# EAGLE schematic DanielDist_board_1.0 (EAGLE 7.6.0)
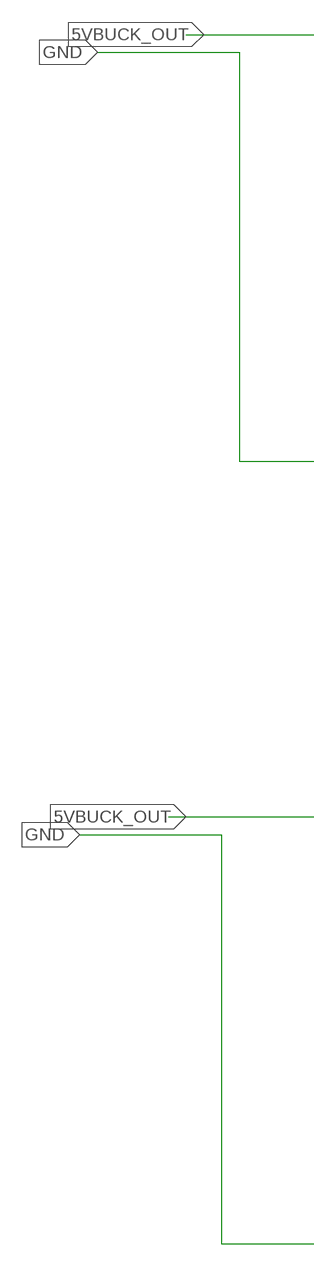
[diagram p0: schematic, sheet 1, part 1 of 3]
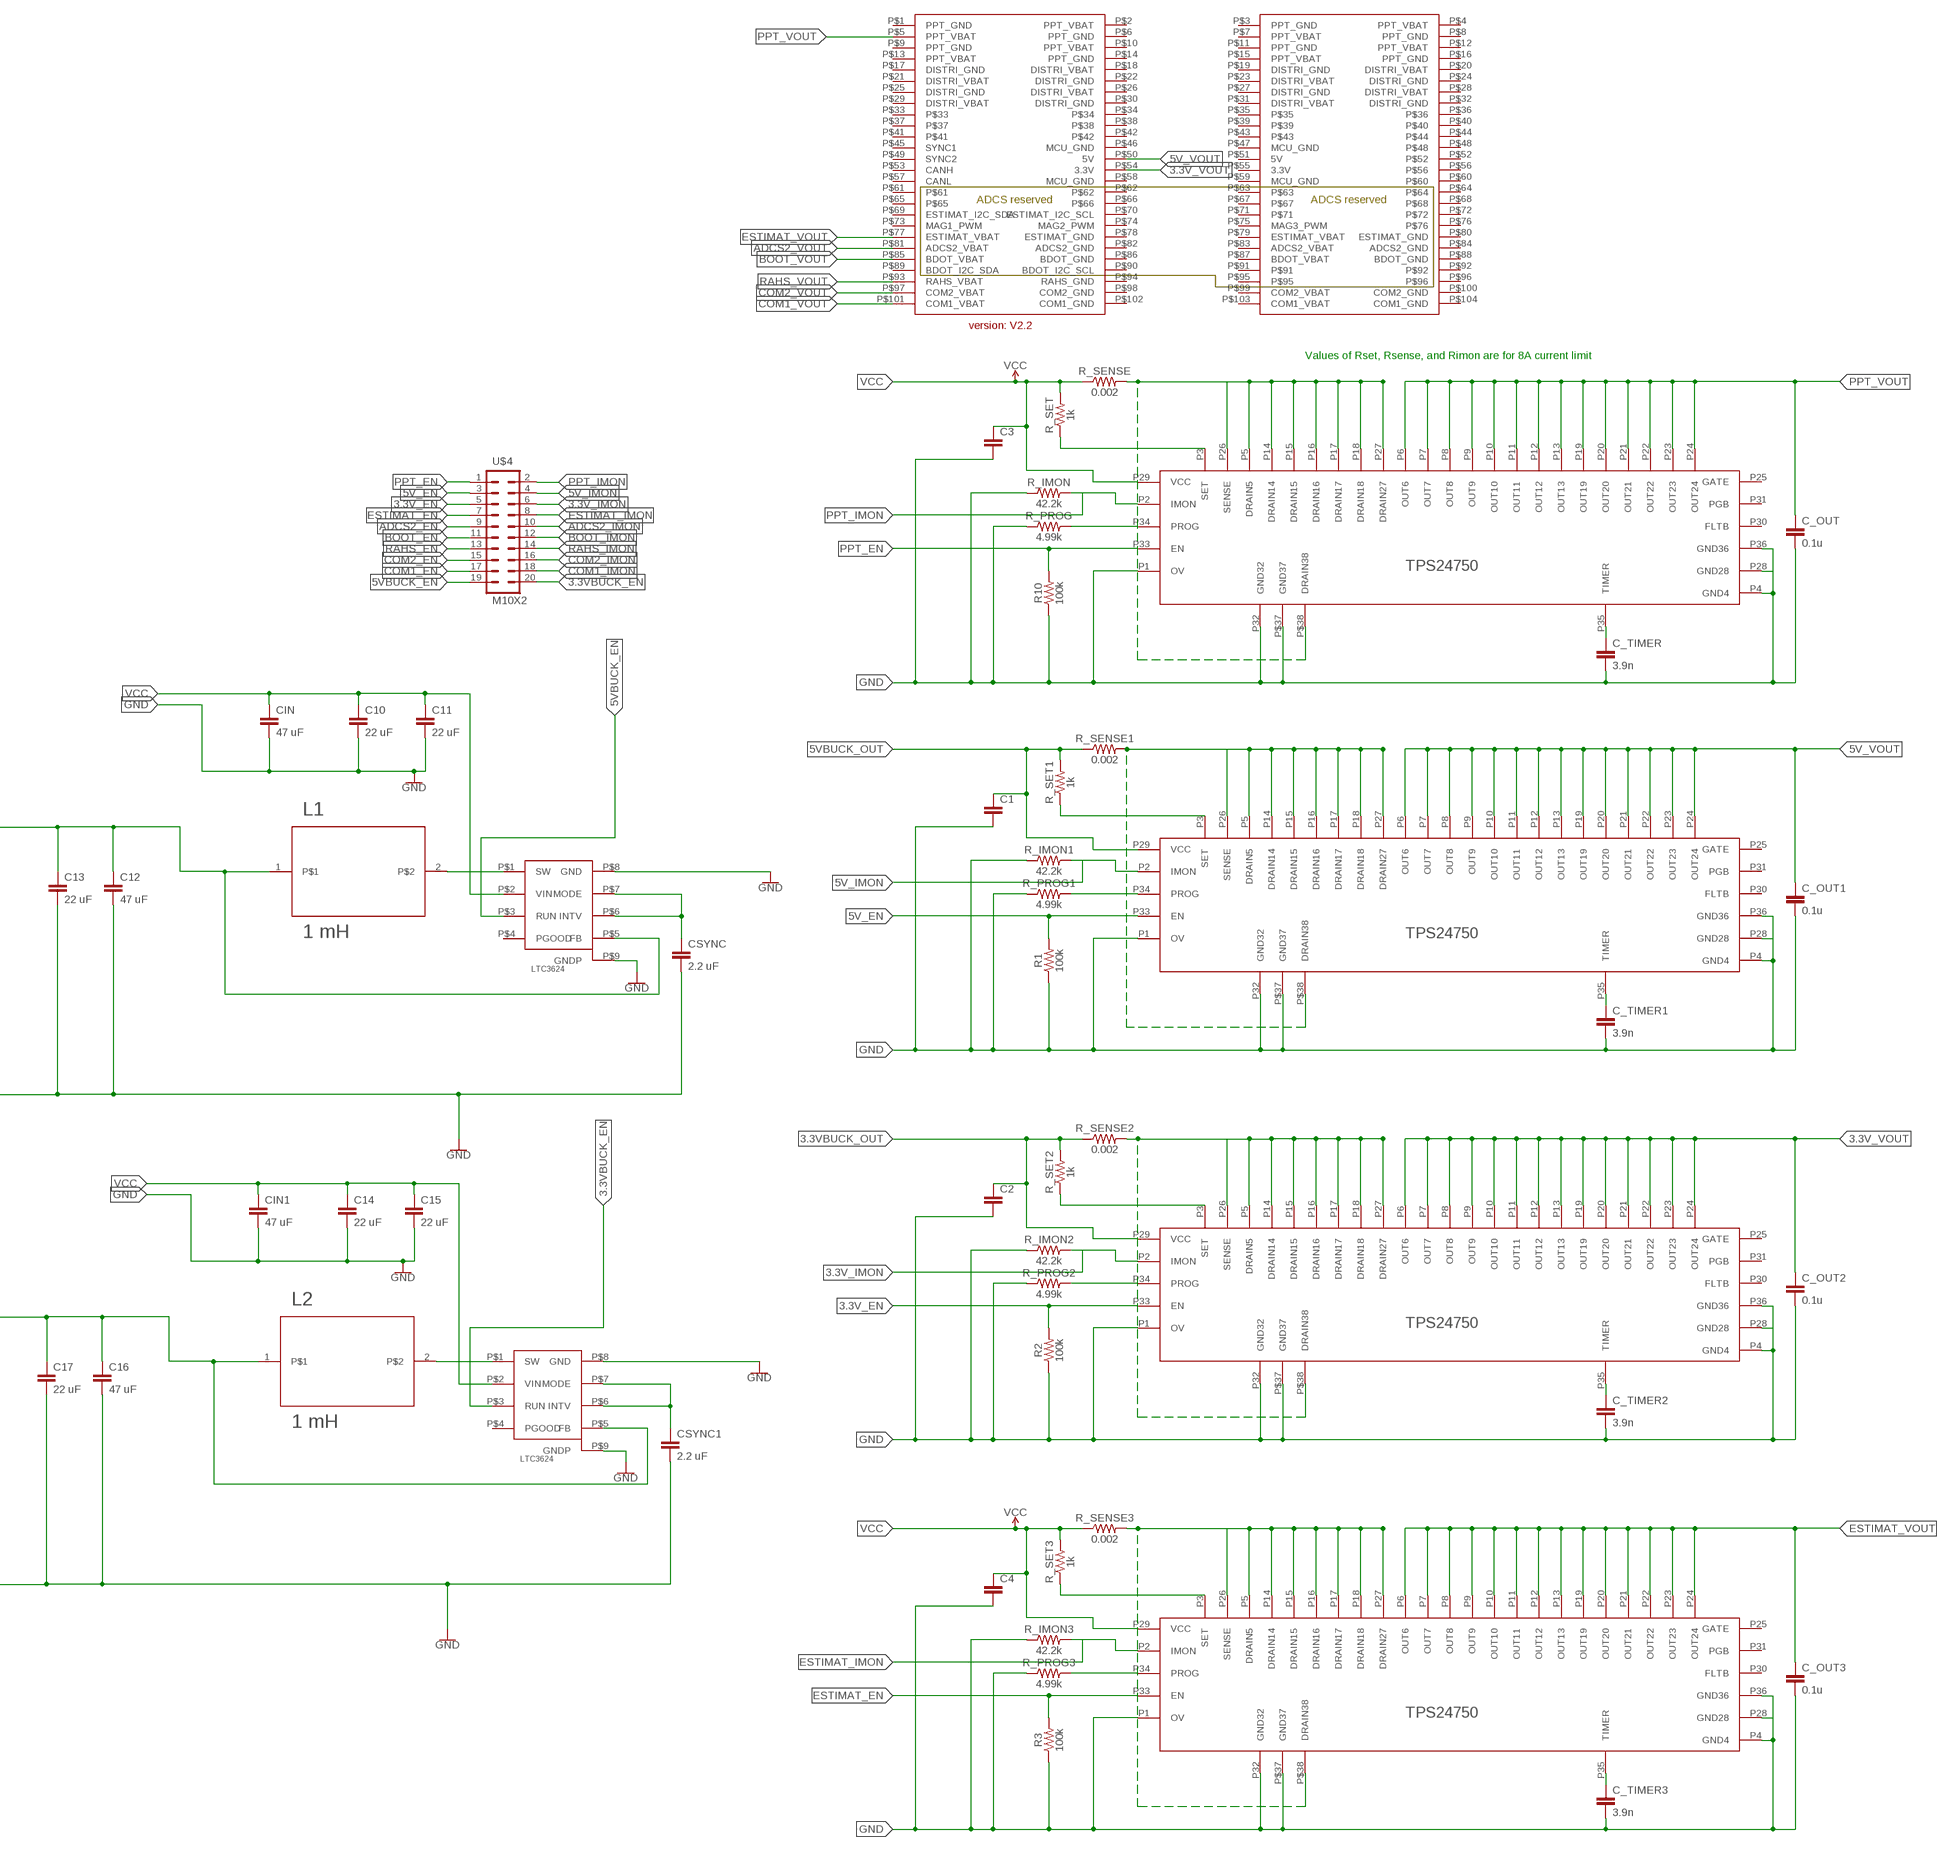
[diagram p1: schematic, sheet 1, part 2 of 3]
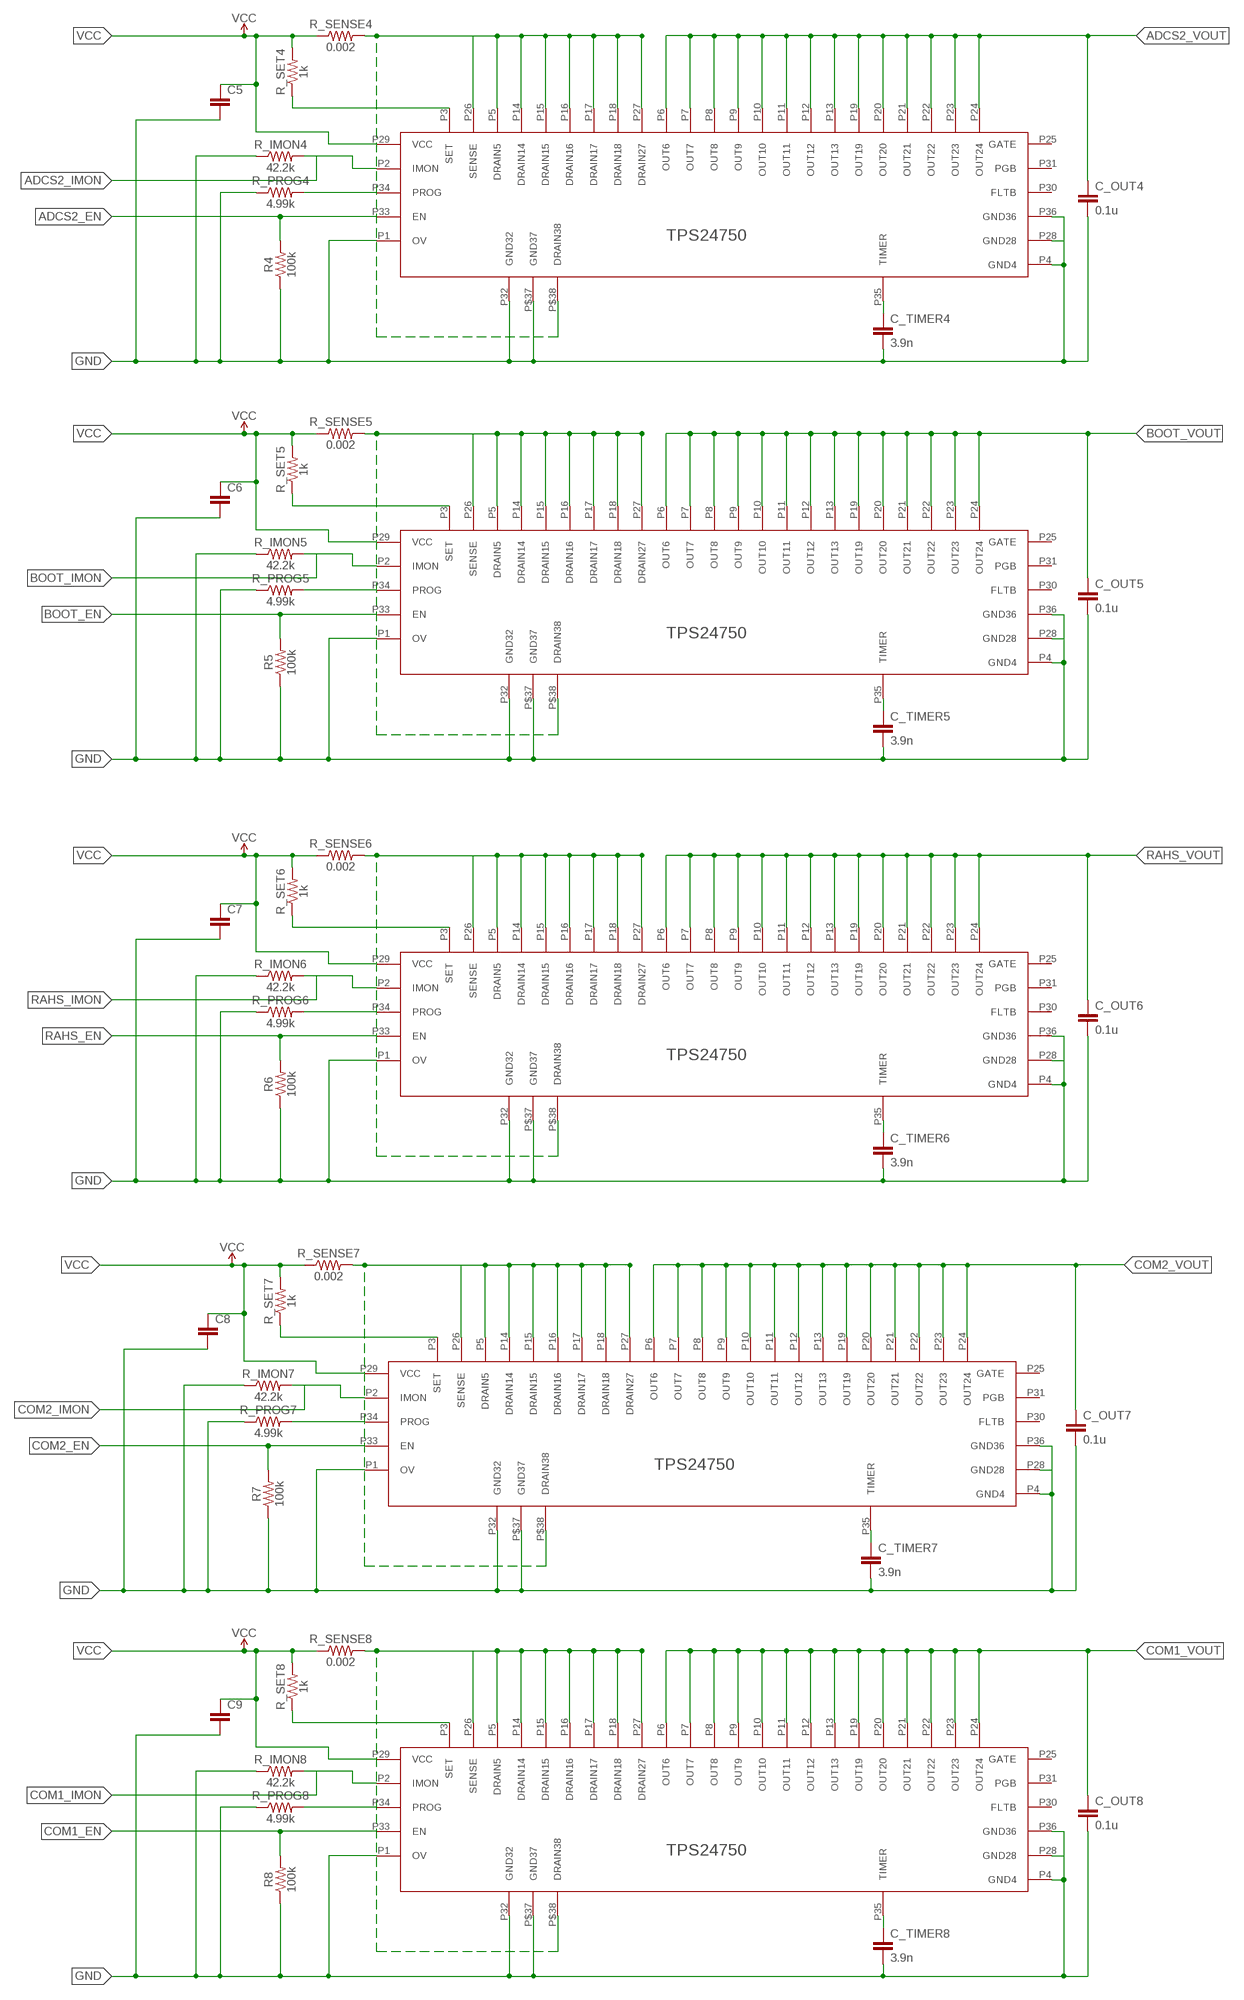
[diagram p2: schematic, sheet 1, part 3 of 3]

## Parts
C1  GEN_CAP_0805SMD  [0805]
C2  GEN_CAP_0805SMD  [0805]
C3  GEN_CAP_0805SMD  [0805]
C4  GEN_CAP_0805SMD  [0805]
C5  GEN_CAP_0805SMD  [0805]
C6  GEN_CAP_0805SMD  [0805]
C7  GEN_CAP_0805SMD  [0805]
C8  GEN_CAP_0805SMD  [0805]
C9  GEN_CAP_0805SMD  [0805]
C10  22 uF  GENERIC_CAPACITOR_1206  [1206]
C11  22 uF  GENERIC_CAPACITOR_1206  [1206]
C12  47 uF  GENERIC_CAPACITOR_1206  [1206]
C13  22 uF  GENERIC_CAPACITOR_1206  [1206]
C14  22 uF  GENERIC_CAPACITOR_1206  [1206]
C15  22 uF  GENERIC_CAPACITOR_1206  [1206]
C16  47 uF  GENERIC_CAPACITOR_1206  [1206]
C17  22 uF  GENERIC_CAPACITOR_1206  [1206]
C_OUT  0.1u  GEN_CAP_0805SMD  [0805]
C_OUT1  0.1u  GEN_CAP_0805SMD  [0805]
C_OUT2  0.1u  GEN_CAP_0805SMD  [0805]
C_OUT3  0.1u  GEN_CAP_0805SMD  [0805]
C_OUT4  0.1u  GEN_CAP_0805SMD  [0805]
C_OUT5  0.1u  GEN_CAP_0805SMD  [0805]
C_OUT6  0.1u  GEN_CAP_0805SMD  [0805]
C_OUT7  0.1u  GEN_CAP_0805SMD  [0805]
C_OUT8  0.1u  GEN_CAP_0805SMD  [0805]
C_TIMER  3.9n  GEN_CAP_0805SMD  [0805]
C_TIMER1  3.9n  GEN_CAP_0805SMD  [0805]
C_TIMER2  3.9n  GEN_CAP_0805SMD  [0805]
C_TIMER3  3.9n  GEN_CAP_0805SMD  [0805]
C_TIMER4  3.9n  GEN_CAP_0805SMD  [0805]
C_TIMER5  3.9n  GEN_CAP_0805SMD  [0805]
C_TIMER6  3.9n  GEN_CAP_0805SMD  [0805]
C_TIMER7  3.9n  GEN_CAP_0805SMD  [0805]
C_TIMER8  3.9n  GEN_CAP_0805SMD  [0805]
CIN  47 uF  GENERIC_CAPACITOR_1206  [1206]
CIN1  47 uF  GENERIC_CAPACITOR_1206  [1206]
CSYNC  2.2 uF  GENERIC_CAPACITOR_0805  [0805]
CSYNC1  2.2 uF  GENERIC_CAPACITOR_0805  [0805]
L1  1 mH  XAL4030-332ME  [COILCRAFT]
L2  1 mH  XAL4030-332ME  [COILCRAFT]
R1  100k  GEN_RES_0805SMD  [0805]
R2  100k  GEN_RES_0805SMD  [0805]
R3  100k  GEN_RES_0805SMD  [0805]
R4  100k  GEN_RES_0805SMD  [0805]
R5  100k  GEN_RES_0805SMD  [0805]
R6  100k  GEN_RES_0805SMD  [0805]
R7  100k  GEN_RES_0805SMD  [0805]
R8  100k  GEN_RES_0805SMD  [0805]
R10  100k  GEN_RES_0805SMD  [0805]
R_IMON  42.2k  GEN_RES_0805SMD  [0805]
R_IMON1  42.2k  GEN_RES_0805SMD  [0805]
R_IMON2  42.2k  GEN_RES_0805SMD  [0805]
R_IMON3  42.2k  GEN_RES_0805SMD  [0805]
R_IMON4  42.2k  GEN_RES_0805SMD  [0805]
R_IMON5  42.2k  GEN_RES_0805SMD  [0805]
R_IMON6  42.2k  GEN_RES_0805SMD  [0805]
R_IMON7  42.2k  GEN_RES_0805SMD  [0805]
R_IMON8  42.2k  GEN_RES_0805SMD  [0805]
R_PROG  4.99k  GEN_RES_0805SMD  [0805]
R_PROG1  4.99k  GEN_RES_0805SMD  [0805]
R_PROG2  4.99k  GEN_RES_0805SMD  [0805]
R_PROG3  4.99k  GEN_RES_0805SMD  [0805]
R_PROG4  4.99k  GEN_RES_0805SMD  [0805]
R_PROG5  4.99k  GEN_RES_0805SMD  [0805]
R_PROG6  4.99k  GEN_RES_0805SMD  [0805]
R_PROG7  4.99k  GEN_RES_0805SMD  [0805]
R_PROG8  4.99k  GEN_RES_0805SMD  [0805]
R_SENSE  0.002  GEN_RES_2010SMD  [2010]
R_SENSE1  0.002  GEN_RES_2010SMD  [2010]
R_SENSE2  0.002  GEN_RES_2010SMD  [2010]
R_SENSE3  0.002  GEN_RES_2010SMD  [2010]
R_SENSE4  0.002  GEN_RES_2010SMD  [2010]
R_SENSE5  0.002  GEN_RES_2010SMD  [2010]
R_SENSE6  0.002  GEN_RES_2010SMD  [2010]
R_SENSE7  0.002  GEN_RES_2010SMD  [2010]
R_SENSE8  0.002  GEN_RES_2010SMD  [2010]
R_SET  1k  GEN_RES_0805SMD  [0805]
R_SET1  1k  GEN_RES_0805SMD  [0805]
R_SET2  1k  GEN_RES_0805SMD  [0805]
R_SET3  1k  GEN_RES_0805SMD  [0805]
R_SET4  1k  GEN_RES_0805SMD  [0805]
R_SET5  1k  GEN_RES_0805SMD  [0805]
R_SET6  1k  GEN_RES_0805SMD  [0805]
R_SET7  1k  GEN_RES_0805SMD  [0805]
R_SET8  1k  GEN_RES_0805SMD  [0805]
U$1  TI_SWITCH_TPS24750  [QFN-36]
U$2  2X26_CONNECTOR_(V2.2)  [4X26_CONNECTOR_(V2.2)]
U$4  M10X2  [2X10]
U$5  TI_SWITCH_TPS24750  [QFN-36]
U$6  TI_SWITCH_TPS24750  [QFN-36]
U$7  TI_SWITCH_TPS24750  [QFN-36]
U$8  TI_SWITCH_TPS24750  [QFN-36]
U$9  TI_SWITCH_TPS24750  [QFN-36]
U$10  TI_SWITCH_TPS24750  [QFN-36]
U$11  TI_SWITCH_TPS24750  [QFN-36]
U$12  TI_SWITCH_TPS24750  [QFN-36]
U$13  LINEAR_BUCK_LTC3624  [8-LFCSP]
U$14  LINEAR_BUCK_LTC3624  [8-LFCSP]

## Nets
3.3V_EN: R2.2 U$4.5 U$6.P33(EN)
3.3V_IMON: R_IMON2.2 U$4.6 U$6.P2(IMON)
3.3V_VOUT: C_OUT2.1 U$2.P$54(3.3V) U$6.P6(OUT6) U$6.P7(OUT7) U$6.P8(OUT8) U$6.P9(OUT9) U$6.P10(OUT10) U$6.P11(OUT11) U$6.P12(OUT12) U$6.P13(OUT13) U$6.P19(OUT19) U$6.P20(OUT20) U$6.P21(OUT21) U$6.P22(OUT22) U$6.P23(OUT23) U$6.P24(OUT24)
3.3VBUCK_EN: U$4.20 U$14.P$3(RUN)
3.3VBUCK_OUT: C2.1 C16.1 C17.1 L2.1 R_SENSE2.1 R_SET2.2 U$6.P29(VCC) U$14.P$5(FB)
5V_EN: R1.2 U$4.3 U$5.P33(EN)
5V_IMON: R_IMON1.2 U$4.4 U$5.P2(IMON)
5V_VOUT: C_OUT1.1 U$2.P$50(5V) U$5.P6(OUT6) U$5.P7(OUT7) U$5.P8(OUT8) U$5.P9(OUT9) U$5.P10(OUT10) U$5.P11(OUT11) U$5.P12(OUT12) U$5.P13(OUT13) U$5.P19(OUT19) U$5.P20(OUT20) U$5.P21(OUT21) U$5.P22(OUT22) U$5.P23(OUT23) U$5.P24(OUT24)
5VBUCK_EN: U$4.19 U$13.P$3(RUN)
5VBUCK_OUT: C1.1 C12.1 C13.1 L1.1 R_SENSE1.1 R_SET1.2 U$5.P29(VCC) U$13.P$5(FB)
ADCS2_EN: R4.2 U$4.9 U$8.P33(EN)
ADCS2_IMON: R_IMON4.2 U$4.10 U$8.P2(IMON)
ADCS2_VOUT: C_OUT4.1 U$2.P$81(ADCS2_VBAT) U$8.P6(OUT6) U$8.P7(OUT7) U$8.P8(OUT8) U$8.P9(OUT9) U$8.P10(OUT10) U$8.P11(OUT11) U$8.P12(OUT12) U$8.P13(OUT13) U$8.P19(OUT19) U$8.P20(OUT20) U$8.P21(OUT21) U$8.P22(OUT22) U$8.P23(OUT23) U$8.P24(OUT24)
BOOT_EN: R5.2 U$9.P33(EN)
BOOT_IMON: R_IMON5.2 U$9.P2(IMON)
BOOT_VOUT: C_OUT5.1 U$2.P$85(BDOT_VBAT) U$9.P6(OUT6) U$9.P7(OUT7) U$9.P8(OUT8) U$9.P9(OUT9) U$9.P10(OUT10) U$9.P11(OUT11) U$9.P12(OUT12) U$9.P13(OUT13) U$9.P19(OUT19) U$9.P20(OUT20) U$9.P21(OUT21) U$9.P22(OUT22) U$9.P23(OUT23) U$9.P24(OUT24)
COM1_EN: R8.2 U$4.17 U$12.P33(EN)
COM1_IMON: R_IMON8.2 U$12.P2(IMON)
COM1_VOUT: C_OUT8.1 U$2.P$101(COM1_VBAT) U$12.P6(OUT6) U$12.P7(OUT7) U$12.P8(OUT8) U$12.P9(OUT9) U$12.P10(OUT10) U$12.P11(OUT11) U$12.P12(OUT12) U$12.P13(OUT13) U$12.P19(OUT19) U$12.P20(OUT20) U$12.P21(OUT21) U$12.P22(OUT22) U$12.P23(OUT23) U$12.P24(OUT24)
COM2_EN: R7.2 U$11.P33(EN)
COM2_IMON: R_IMON7.2 U$4.16 U$11.P2(IMON)
COM2_VOUT: C_OUT7.1 U$2.P$97(COM2_VBAT) U$11.P6(OUT6) U$11.P7(OUT7) U$11.P8(OUT8) U$11.P9(OUT9) U$11.P10(OUT10) U$11.P11(OUT11) U$11.P12(OUT12) U$11.P13(OUT13) U$11.P19(OUT19) U$11.P20(OUT20) U$11.P21(OUT21) U$11.P22(OUT22) U$11.P23(OUT23) U$11.P24(OUT24)
DRAIN: R_SENSE.2 U$1.P5(DRAIN5) U$1.P14(DRAIN14) U$1.P15(DRAIN15) U$1.P16(DRAIN16) U$1.P17(DRAIN17) U$1.P18(DRAIN18) U$1.P26(SENSE) U$1.P27(DRAIN27) U$1.P$38(DRAIN38)
DRAIN1: R_SENSE1.2 U$5.P5(DRAIN5) U$5.P14(DRAIN14) U$5.P15(DRAIN15) U$5.P16(DRAIN16) U$5.P17(DRAIN17) U$5.P18(DRAIN18) U$5.P26(SENSE) U$5.P27(DRAIN27) U$5.P$38(DRAIN38)
DRAIN2: R_SENSE2.2 U$6.P5(DRAIN5) U$6.P14(DRAIN14) U$6.P15(DRAIN15) U$6.P16(DRAIN16) U$6.P17(DRAIN17) U$6.P18(DRAIN18) U$6.P26(SENSE) U$6.P27(DRAIN27) U$6.P$38(DRAIN38)
DRAIN3: R_SENSE3.2 U$7.P5(DRAIN5) U$7.P14(DRAIN14) U$7.P15(DRAIN15) U$7.P16(DRAIN16) U$7.P17(DRAIN17) U$7.P18(DRAIN18) U$7.P26(SENSE) U$7.P27(DRAIN27) U$7.P$38(DRAIN38)
DRAIN4: R_SENSE4.2 U$8.P5(DRAIN5) U$8.P14(DRAIN14) U$8.P15(DRAIN15) U$8.P16(DRAIN16) U$8.P17(DRAIN17) U$8.P18(DRAIN18) U$8.P26(SENSE) U$8.P27(DRAIN27) U$8.P$38(DRAIN38)
DRAIN5: R_SENSE5.2 U$9.P5(DRAIN5) U$9.P14(DRAIN14) U$9.P15(DRAIN15) U$9.P16(DRAIN16) U$9.P17(DRAIN17) U$9.P18(DRAIN18) U$9.P26(SENSE) U$9.P27(DRAIN27) U$9.P$38(DRAIN38)
DRAIN6: R_SENSE6.2 U$10.P5(DRAIN5) U$10.P14(DRAIN14) U$10.P15(DRAIN15) U$10.P16(DRAIN16) U$10.P17(DRAIN17) U$10.P18(DRAIN18) U$10.P26(SENSE) U$10.P27(DRAIN27) U$10.P$38(DRAIN38)
DRAIN7: R_SENSE7.2 U$11.P5(DRAIN5) U$11.P14(DRAIN14) U$11.P15(DRAIN15) U$11.P16(DRAIN16) U$11.P17(DRAIN17) U$11.P18(DRAIN18) U$11.P26(SENSE) U$11.P27(DRAIN27) U$11.P$38(DRAIN38)
DRAIN8: R_SENSE8.2 U$12.P5(DRAIN5) U$12.P14(DRAIN14) U$12.P15(DRAIN15) U$12.P16(DRAIN16) U$12.P17(DRAIN17) U$12.P18(DRAIN18) U$12.P26(SENSE) U$12.P27(DRAIN27) U$12.P$38(DRAIN38)
ESTIMAT_EN: R3.2 U$4.7 U$7.P33(EN)
ESTIMAT_IMON: R_IMON3.2 U$4.8 U$7.P2(IMON)
ESTIMAT_VOUT: C_OUT3.1 U$2.P$77(ESTIMAT_VBAT) U$7.P6(OUT6) U$7.P7(OUT7) U$7.P8(OUT8) U$7.P9(OUT9) U$7.P10(OUT10) U$7.P11(OUT11) U$7.P12(OUT12) U$7.P13(OUT13) U$7.P19(OUT19) U$7.P20(OUT20) U$7.P21(OUT21) U$7.P22(OUT22) U$7.P23(OUT23) U$7.P24(OUT24)
GND: C1.2 C2.2 C3.2 C4.2 C5.2 C6.2 C7.2 C8.2 C9.2 C10.2 C11.2 C12.2 C13.2 C14.2 C15.2 C16.2 C17.2 C_OUT1.2 C_OUT2.2 C_OUT3.2 C_OUT4.2 C_OUT5.2 C_OUT6.2 C_OUT7.2 C_OUT8.2 C_OUT.2 C_TIMER1.2 C_TIMER2.2 C_TIMER3.2 C_TIMER4.2 C_TIMER5.2 C_TIMER6.2 C_TIMER7.2 C_TIMER8.2 C_TIMER.2 CIN1.2 CIN.2 CSYNC1.2 CSYNC.2 R1.1 R2.1 R3.1 R4.1 R5.1 R6.1 R7.1 R8.1 R10.1 R_IMON1.1 R_IMON2.1 R_IMON3.1 R_IMON4.1 R_IMON5.1 R_IMON6.1 R_IMON7.1 R_IMON8.1 R_IMON.1 R_PROG1.1 R_PROG2.1 R_PROG3.1 R_PROG4.1 R_PROG5.1 R_PROG6.1 R_PROG7.1 R_PROG8.1 R_PROG.1 U$1.P1(OV) U$1.P4(GND4) U$1.P28(GND28) U$1.P32(GND32) U$1.P36(GND36) U$1.P$37(GND37) U$5.P1(OV) U$5.P4(GND4) U$5.P28(GND28) U$5.P32(GND32) U$5.P36(GND36) U$5.P$37(GND37) U$6.P1(OV) U$6.P4(GND4) U$6.P28(GND28) U$6.P32(GND32) U$6.P36(GND36) U$6.P$37(GND37) U$7.P1(OV) U$7.P4(GND4) U$7.P28(GND28) U$7.P32(GND32) U$7.P36(GND36) U$7.P$37(GND37) U$8.P1(OV) U$8.P4(GND4) U$8.P28(GND28) U$8.P32(GND32) U$8.P36(GND36) U$8.P$37(GND37) U$9.P1(OV) U$9.P4(GND4) U$9.P28(GND28) U$9.P32(GND32) U$9.P36(GND36) U$9.P$37(GND37) U$10.P1(OV) U$10.P4(GND4) U$10.P28(GND28) U$10.P32(GND32) U$10.P36(GND36) U$10.P$37(GND37) U$11.P1(OV) U$11.P4(GND4) U$11.P28(GND28) U$11.P32(GND32) U$11.P36(GND36) U$11.P$37(GND37) U$12.P1(OV) U$12.P4(GND4) U$12.P28(GND28) U$12.P32(GND32) U$12.P36(GND36) U$12.P$37(GND37) U$13.P$8(GND) U$13.P$9(GNDP) U$14.P$8(GND) U$14.P$9(GNDP)
INPUT6_EN: U$4.11
INPUT6_IMON: U$4.12
INPUT8_EN: U$4.15
INPUT9_IMON: U$4.18
MODE: CSYNC.1 U$13.P$6(INTV) U$13.P$7(MODE)
MODE1: CSYNC1.1 U$14.P$6(INTV) U$14.P$7(MODE)
PPT_EN: R10.2 U$1.P33(EN) U$4.1
PPT_IMON: R_IMON.2 U$1.P2(IMON) U$4.2
PPT_VOUT: C_OUT.1 U$1.P6(OUT6) U$1.P7(OUT7) U$1.P8(OUT8) U$1.P9(OUT9) U$1.P10(OUT10) U$1.P11(OUT11) U$1.P12(OUT12) U$1.P13(OUT13) U$1.P19(OUT19) U$1.P20(OUT20) U$1.P21(OUT21) U$1.P22(OUT22) U$1.P23(OUT23) U$1.P24(OUT24) U$2.P$5(PPT_VBAT)
PROG: R_PROG.2 U$1.P34(PROG)
PROG1: R_PROG1.2 U$5.P34(PROG)
PROG2: R_PROG2.2 U$6.P34(PROG)
PROG3: R_PROG3.2 U$7.P34(PROG)
PROG4: R_PROG4.2 U$8.P34(PROG)
PROG5: R_PROG5.2 U$9.P34(PROG)
PROG6: R_PROG6.2 U$10.P34(PROG)
PROG7: R_PROG7.2 U$11.P34(PROG)
PROG8: R_PROG8.2 U$12.P34(PROG)
RAHS_EN: R6.2 U$4.13 U$10.P33(EN)
RAHS_IMON: R_IMON6.2 U$4.14 U$10.P2(IMON)
RAHS_VOUT: C_OUT6.1 U$2.P$93(RAHS_VBAT) U$10.P6(OUT6) U$10.P7(OUT7) U$10.P8(OUT8) U$10.P9(OUT9) U$10.P10(OUT10) U$10.P11(OUT11) U$10.P12(OUT12) U$10.P13(OUT13) U$10.P19(OUT19) U$10.P20(OUT20) U$10.P21(OUT21) U$10.P22(OUT22) U$10.P23(OUT23) U$10.P24(OUT24)
SET: R_SET.1 U$1.P3(SET)
SET1: R_SET1.1 U$5.P3(SET)
SET2: R_SET2.1 U$6.P3(SET)
SET3: R_SET3.1 U$7.P3(SET)
SET4: R_SET4.1 U$8.P3(SET)
SET5: R_SET5.1 U$9.P3(SET)
SET6: R_SET6.1 U$10.P3(SET)
SET7: R_SET7.1 U$11.P3(SET)
SET8: R_SET8.1 U$12.P3(SET)
SW: L1.2 U$13.P$1(SW)
SW1: L2.2 U$14.P$1(SW)
TIMER: C_TIMER.1 U$1.P35(TIMER)
TIMER1: C_TIMER1.1 U$5.P35(TIMER)
TIMER2: C_TIMER2.1 U$6.P35(TIMER)
TIMER3: C_TIMER3.1 U$7.P35(TIMER)
TIMER4: C_TIMER4.1 U$8.P35(TIMER)
TIMER5: C_TIMER5.1 U$9.P35(TIMER)
TIMER6: C_TIMER6.1 U$10.P35(TIMER)
TIMER7: C_TIMER7.1 U$11.P35(TIMER)
TIMER8: C_TIMER8.1 U$12.P35(TIMER)
VCC: C3.1 C4.1 C5.1 C6.1 C7.1 C8.1 C9.1 C10.1 C11.1 C14.1 C15.1 CIN1.1 CIN.1 R_SENSE3.1 R_SENSE4.1 R_SENSE5.1 R_SENSE6.1 R_SENSE7.1 R_SENSE8.1 R_SENSE.1 R_SET3.2 R_SET4.2 R_SET5.2 R_SET6.2 R_SET7.2 R_SET8.2 R_SET.2 U$1.P29(VCC) U$7.P29(VCC) U$8.P29(VCC) U$9.P29(VCC) U$10.P29(VCC) U$11.P29(VCC) U$12.P29(VCC) U$13.P$2(VIN) U$14.P$2(VIN)
Unconnected: U$1.P25(GATE) U$1.P30(FLTB) U$1.P31(PGB) U$2.P$1(PPT_GND) U$2.P$2(PPT_VBAT) U$2.P$3(PPT_GND) U$2.P$4(PPT_VBAT) U$2.P$6(PPT_GND) U$2.P$7(PPT_VBAT) U$2.P$8(PPT_GND) U$2.P$9(PPT_GND) U$2.P$10(PPT_VBAT) U$2.P$11(PPT_GND) U$2.P$12(PPT_VBAT) U$2.P$13(PPT_VBAT) U$2.P$14(PPT_GND) U$2.P$15(PPT_VBAT) U$2.P$16(PPT_GND) U$2.P$17(DISTRI_GND) U$2.P$18(DISTRI_VBAT) U$2.P$19(DISTRI_GND) U$2.P$20(DISTRI_VBAT) U$2.P$21(DISTRI_VBAT) U$2.P$22(DISTRI_GND) U$2.P$23(DISTRI_VBAT) U$2.P$24(DISTRI_GND) U$2.P$25(DISTRI_GND) U$2.P$26(DISTRI_VBAT) U$2.P$27(DISTRI_GND) U$2.P$28(DISTRI_VBAT) U$2.P$29(DISTRI_VBAT) U$2.P$30(DISTRI_GND) U$2.P$31(DISTRI_VBAT) U$2.P$32(DISTRI_GND) U$2.P$33 U$2.P$34 U$2.P$35 U$2.P$36 U$2.P$37 U$2.P$38 U$2.P$39 U$2.P$40 U$2.P$41 U$2.P$42 U$2.P$43 U$2.P$44 U$2.P$45(SYNC1) U$2.P$46(MCU_GND) U$2.P$47(MCU_GND) U$2.P$48 U$2.P$49(SYNC2) U$2.P$51(5V) U$2.P$52 U$2.P$53(CANH) U$2.P$55(3.3V) U$2.P$56 U$2.P$57(CANL) U$2.P$58(MCU_GND) U$2.P$59(MCU_GND) U$2.P$60 U$2.P$61 U$2.P$62 U$2.P$63 U$2.P$64 U$2.P$65 U$2.P$66 U$2.P$67 U$2.P$68 U$2.P$69(ESTIMAT_I2C_SDA) U$2.P$70(ESTIMAT_I2C_SCL) U$2.P$71 U$2.P$72 U$2.P$73(MAG1_PWM) U$2.P$74(MAG2_PWM) U$2.P$75(MAG3_PWM) U$2.P$76 U$2.P$78(ESTIMAT_GND) U$2.P$79(ESTIMAT_VBAT) U$2.P$80(ESTIMAT_GND) U$2.P$82(ADCS2_GND) U$2.P$83(ADCS2_VBAT) U$2.P$84(ADCS2_GND) U$2.P$86(BDOT_GND) U$2.P$87(BDOT_VBAT) U$2.P$88(BDOT_GND) U$2.P$89(BDOT_I2C_SDA) U$2.P$90(BDOT_I2C_SCL) U$2.P$91 U$2.P$92 U$2.P$94(RAHS_GND) U$2.P$95 U$2.P$96 U$2.P$98(COM2_GND) U$2.P$99(COM2_VBAT) U$2.P$100(COM2_GND) U$2.P$102(COM1_GND) U$2.P$103(COM1_VBAT) U$2.P$104(COM1_GND) U$5.P25(GATE) U$5.P30(FLTB) U$5.P31(PGB) U$6.P25(GATE) U$6.P30(FLTB) U$6.P31(PGB) U$7.P25(GATE) U$7.P30(FLTB) U$7.P31(PGB) U$8.P25(GATE) U$8.P30(FLTB) U$8.P31(PGB) U$9.P25(GATE) U$9.P30(FLTB) U$9.P31(PGB) U$10.P25(GATE) U$10.P30(FLTB) U$10.P31(PGB) U$11.P25(GATE) U$11.P30(FLTB) U$11.P31(PGB) U$12.P25(GATE) U$12.P30(FLTB) U$12.P31(PGB) U$13.P$4(PGOOD) U$14.P$4(PGOOD)

## Notes on the sheet
- Values of Rset, Rsense, and Rimon are for 8A current limit

## Library data of the parts
C1-C9 C_OUT C_OUT1-C_OUT8 C_TIMER C_TIMER1-C_TIMER8 = SparkFun-Capacitors:GEN_CAP_0805
C10-C17 CIN CIN1 = SparkFun-Capacitors:GENERIC_CAPACITOR_1206
CSYNC CSYNC1 = SparkFun-Capacitors:GENERIC_CAPACITOR_0805
L1 L2 = Inductors:XAL4030-332ME
R1-R8 R10 R_IMON R_IMON1-R_IMON8 R_PROG R_PROG1-R_PROG8 R_SET R_SET1-R_SET8 = SparkFun-Resistors:GEN_RES_0805: Generic resistor with no value
R_SENSE R_SENSE1-R_SENSE8 = SparkFun-Resistors:GEN_RES_2010
U$1 U$5-U$12 = ICs:TI_SWITCH_TPS24750
U$2 = CubeSat(V2.2):2X26_CONNECTOR_(V2.2)
U$4 = SparkFun-Connectors:M10X2: This was SPECIALLY designed to be used with our Graphic LCD Backpack. Be sure you want to use this! It is not only staggered on each line of header holes, but IT IS ALSO offset of the center point of the top and bottom lines by 5 mil. This causes the headers to lock into place on the "standard" footprint on the LCD screen. The extra squares on the tdocu layer are there simply to reference other pins (if you were to actually populate a longer header than ten long - this is what we do with the backpacks).
U$13 U$14 = ICs:LINEAR_BUCK_LTC3624